# EAGLE design xbox360 charger (EAGLE 6.5.0)
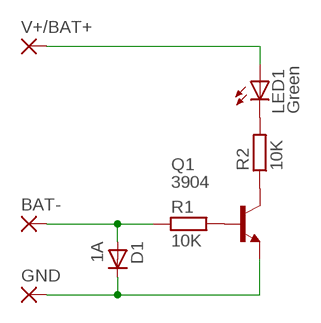
[diagram p0: schematic, sheet 1]

## Parts
BAT-  SMD5  [SMD2,54-5,08]
D1  1A  DIODE_SMB  [DIOM5436X265N]
GND  SMD5  [SMD2,54-5,08]
LED1  Green  LEDSML0603  [SML0603]
Q1  3904  NPN_SOT-23  [SOT95P280X135-3N]
R1  10K  RESISTOR_0603  [RESC1608X55N]
R2  10K  RESISTOR_0603  [RESC1608X55N]
V+/BAT+  SMD5  [SMD2,54-5,08]

## Nets
N$1: Q1.3(C) R2.1
N$2: D1.K GND.1(P) Q1.2(E)
N$3: BAT-.1(P) D1.A R1.1
N$4: Q1.1(B) R1.2
N$5: LED1.C R2.2
N$6: LED1.A V+/BAT+.1(P)

## Library data of the parts
BAT- GND V+/BAT+ = wirepad:SMD5: SMD PAD
D1 = ipc-7351-diode:DIODE_
LED1 = led:LED: LED OSRAM: - CHIPLED LG R971, LG N971, LY N971, LG Q971, LY Q971, LO R971, LY R971 LH N974, LH R974 LS Q976, LO Q976, LY Q976 LO Q996 - Hyper CHIPLED LW Q18S LB Q993, LB Q99A, LB R99A - SideLED LS A670, LO A670, LY A670, LG A670, LP A670 LB A673, LV A673, LT A673, LW A673 LH A674 LY A675 LS A676, LA A676, LO A676, LY A676, LW A676 LS A679, LY A679, LG A679 - Hyper Micro SIDELED® LS Y876, LA Y876, LO Y876, LY Y876 LT Y87S - SmartLED LW L88C, LW L88S LB L89C, LB L89S, LG L890 LS L89K, LO L89K, LY L89K LS L896, LA L896, LO L896, LY L896 - TOPLED LS T670, LO T670, LY T670, LG T670, LP T670 LSG T670, LSP T670, LSY T670, LOP T670, LYG T670 LG T671, LOG T671, LSG T671 LB T673, LV T673, LT T673, LW T673 LH T674 LS T676, LA T676, LO T676, LY T676, LB T676, LH T676, LSB T676, LW T676 LB T67C, LV T67C, LT T67C, LS T67K, LO T67K, LY T67K, LW E67C LS E67B, LA E67B, LO E67B, LY E67B, LB E67C, LV E67C, LT E67C LW T67C LS T679, LY T679, LG T679 LS T770, LO T770, LY T770, LG T770, LP T770 LB T773, LV T773, LT T773, LW T773 LH T774 LS E675, LA E675, LY E675, LS T675 LS T776, LA T776, LO T776, LY T776, LB T776 LHGB T686 LT T68C, LB T68C - Hyper Mini TOPLED® LB M676 - Mini TOPLED Santana® LG M470 LS M47K, LO M47K, LY M47K Source: http://www.osram.convergy.de LUXEON: - LUMILED® LXK2-PW12-R00, LXK2-PW12-S00, LXK2-PW14-U00, LXK2-PW14-V00 LXK2-PM12-R00, LXK2-PM12-S00, LXK2-PM14-U00 LXK2-PE12-Q00, LXK2-PE12-R00, LXK2-PE12-S00, LXK2-PE14-T00, LXK2-PE14-U00 LXK2-PB12-K00, LXK2-PB12-L00, LXK2-PB12-M00, LXK2-PB14-N00, LXK2-PB14-P00, LXK2-PB14-Q00 LXK2-PR12-L00, LXK2-PR12-M00, LXK2-PR14-Q00, LXK2-PR14-R00 LXK2-PD12-Q00, LXK2-PD12-R00, LXK2-PD12-S00 LXK2-PH12-R00, LXK2-PH12-S00 LXK2-PL12-P00, LXK2-PL12-Q00, LXK2-PL12-R00 Source: www.luxeon.com KINGBRIGHT: KA-3528ASYC Source: www.kingbright.com
Q1 = ipc-7351-transistor:NPN_
R1 R2 = ipc-7351-resistor:RESISTOR_

## Board
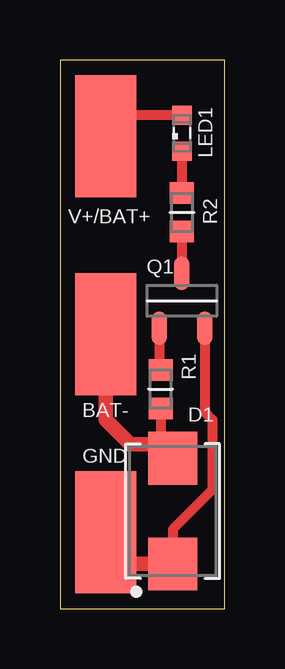
[diagram p1: board, top side]

Size 6.86 x 22.86 mm. Coordinates in mm from the lower left corner, seen from the top.
Outline: 0,0 6.86,0 6.86,22.86 0,22.86 0,0
Copper layers (1*16): Top 0.035559375mm / dielectric 1.6mm / Bottom 0.035559375mm
Design rules "oshpark-2layer-tented-vias": minimum track width 6mil, minimum drill 10mil, track to track 6mil, track to pad 6mil, pad to pad 6mil, via to via 6mil, smd to smd 6mil, copper to edge 15mil, drill to drill 6mil, minimum pad ring 5mil, minimum via ring 5mil, stop-mask expansion 2.5mil, vias tented up to drill 13mil, thermal gap 10mil

### Footprints (pad centres in the part's own frame; a part is rotated, then mirrored left to right if it is on the bottom)
SMD2,54-5,08 = smd 2.54 x 5.08: 1 0,0
DIOM5436X265N = smd 2.2 x 2.05: A 2.2,0; K -2.2,0
SML0603 = smd 0.8 x 0.8: A 0.75,0; C -0.75,0
SOT95P280X135-3N = smd 1.4 x 0.65: 1 -1.15,0.95; 2 -1.15,-0.95; 3 1.15,0
RESC1608X55N = smd 0.9 x 1: 1 -0.8,0; 2 0.8,0

### Placement (x,y rotation side)
BAT-  1.91,11.43 0 top
D1  4.7,4.06 90 top
GND  1.91,3.17 0 top
LED1  5.08,19.81 90 top
Q1  5.08,12.83 90 top
R1  4.19,9.14 90 top
R2  5.08,16.51 90 top
V+/BAT+  1.91,19.68 0 top

### Tracks (layer width: path | path; a pad name or v marks a point on that pad's centre or on a via)
N$1
  Top 0.406: R2.1 Q1.3
N$2
  Top 0.406: D1.K 4.7,3.3 6.35,4.95 6.35,7.87 6.03,8.19 Q1.2
  Top 0.61: D1.K 2.71,1.86 1.91,2.67 GND.1
N$3
  Top 0.406: 1.91,12.19 BAT-.1 | R1.1 4.19,6.77 D1.A
  Top 0.61: D1.A 4.7,6.73 4.57,6.86 2.92,6.86 1.91,7.87 BAT-.1
N$4
  Top 0.406: Q1.1 4.13,10.01 R1.2
N$5
  Top 0.406: LED1.C R2.2
N$6
  Top 0.406: LED1.A 2.78,20.56 V+/BAT+.1